# EAGLE design KineticHarvester_SIG_UFL_5 (EAGLE 9.6.2)
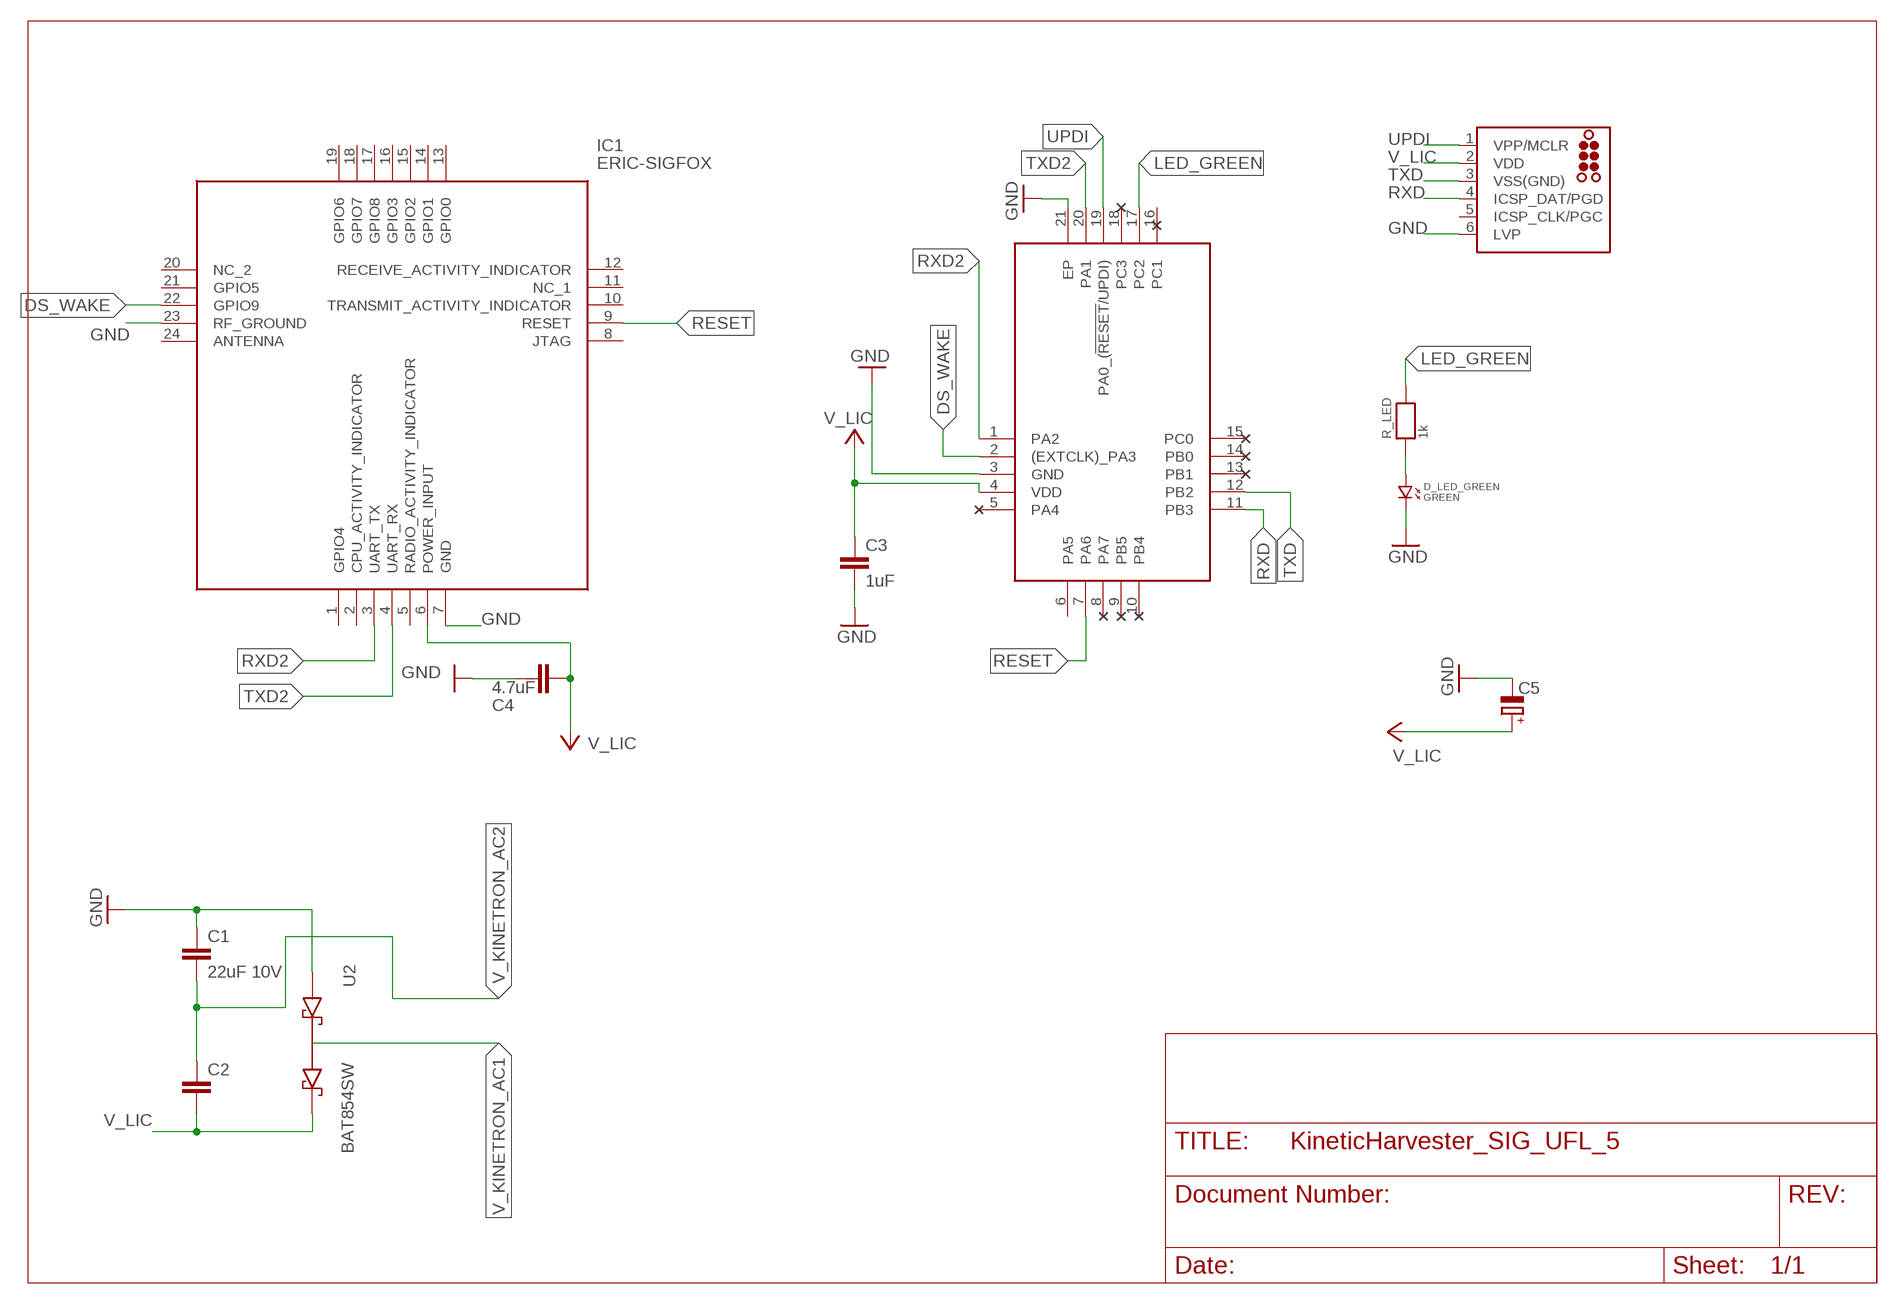
[diagram p0: schematic, sheet 1]

## Parts
ATTINY  ATTINY1616-MFR  [QFN40P300X300X90-21N]
C1  22uF 10V  C0603_22UF  [C0603]
C2  22uF 10V  C0603_22UF  [C0603]
C3  1uF  C0402_1UF  [C0402]
C4  4.7uF  C0402_4.7UF  [C0402]
C5  CPOL-EUE3.5-8  [E3,5-8]
D_LED_GREEN  GREEN  CMONR_STANDARDPARTS_LED.0402  [CMONR_STANDARDPARTS_0402.LED]
IC1  ERIC-SIGFOX  [ERICSIGFOX]
J1  TC2030-MCP-NL  [TC2030-MCP-NL]
R_LED  1k  MICROBUILDER_RESISTOR_0402MP  [MICROBUILDER__0402MP]
U2  BAT854SW  [SOT323]

## Nets
DS_WAKE: ATTINY.2((EXTCLK)_PA3) IC1.22(GPIO9)
GND: ATTINY.3(GND) ATTINY.21(EP) C1.1 C3.2 C4.2 C5.- D_LED_GREEN.P$2 IC1.7(GND) IC1.23(RF_GROUND) J1.6(LVP) U2.2(PIN1)
LED_GREEN: ATTINY.17(PC2) R_LED.2
N$9: D_LED_GREEN.P$1 R_LED.1
RESET: ATTINY.7(PA6) IC1.9(RESET)
RXD: ATTINY.11(PB3) J1.4(ICSP_DAT/PGD)
RXD2: ATTINY.1(PA2) IC1.3(UART_TX)
TXD: ATTINY.12(PB2) J1.3(VSS(GND))
TXD2: ATTINY.20(PA1) IC1.4(UART_RX)
UPDI: ATTINY.19(PA0_(!RESET!/UPDI)) J1.1(VPP/MCLR)
V_KINETRON_AC1: U2.1(PIN3)
V_KINETRON_AC2: C1.2 C2.1
V_LIC: ATTINY.4(VDD) C2.2 C3.1 C4.1 C5.+ IC1.6(POWER_INPUT) J1.2(VDD) U2.3(PIN2) ; supply symbol labelled VCC
Unconnected: ATTINY.5(PA4) ATTINY.6(PA5) ATTINY.8(PA7) ATTINY.9(PB5) ATTINY.10(PB4) ATTINY.13(PB1) ATTINY.14(PB0) ATTINY.15(PC0) ATTINY.16(PC1) ATTINY.18(PC3) IC1.1(GPIO4) IC1.2(CPU_ACTIVITY_INDICATOR) IC1.5(RADIO_ACTIVITY_INDICATOR) IC1.8(JTAG) IC1.10(TRANSMIT_ACTIVITY_INDICATOR) IC1.11(NC_1) IC1.12(RECEIVE_ACTIVITY_INDICATOR) IC1.13(GPIO0) IC1.14(GPIO1) IC1.15(GPIO2) IC1.16(GPIO3) IC1.17(GPIO8) IC1.18(GPIO7) IC1.19(GPIO6) IC1.20(NC_2) IC1.21(GPIO5) IC1.24(ANTENNA) J1.5(ICSP_CLK/PGC)

## Library data of the parts
ATTINY = ATTINY1616-MFR:ATTINY1616-MFR: 8-bit Microcontrollers - MCU 20MHz, 16KB, VQFN20, Ind 125C, Green, T&R Source: Datasheet <http://ww1.microchip.com/downloads/en/DeviceDoc/ATtiny806_1606_Data_Sheet_40002029A.pdf>; DESCRIPTION: 8-bit Microcontrollers - MCU 20MHz, 16KB, VQFN20, Ind 125C, Green, T&R; HEIGHT: 0.9mm; MANUFACTURER_NAME: Microchip; MANUFACTURER_PART_NUMBER: ATTINY1606-MFR; MOUSER_PART_NUMBER: 556-ATTINY1606-MFR; MOUSER_PRICE-STOCK: https://www.mouser.com/Search/Refine.aspx?Keyword=556-ATTINY1606-MFR
C1 C2 = TSEM:C: Non-polarized capacitor; FARNELL_OC: 2426957; MF: Murata; MPN: GRM188R61A226ME15D
C3 = TSEM:C: Non-polarized capacitor; FARNELL_OC: 2672103
C4 = TSEM:C: Non-polarized capacitor; FARNELL_OC: 2426952; MF: Murata; MPN: GRM155R60J475ME47D
C5 = qfm-trx1-24g:CPOL-EU: POLARIZED CAPACITOR, European symbol
D_LED_GREEN = TinyPICO:CMONR_STANDARDPARTS_LED
IC1 = eRIC-SIGFOX:ERIC-SIGFOX: LPRS eRIC-SIGFOX, Transceiver RF Transceiver 868 MHz, 2.5 5V Source: Datasheet <https://componentsearchengine.com/Datasheets/1/eRIC-SIGFOX.pdf>; DESCRIPTION: LPRS eRIC-SIGFOX, Transceiver RF Transceiver 868 MHz, 2.5 5V; HEIGHT: 2mm; MANUFACTURER_NAME: LPRS; MANUFACTURER_PART_NUMBER: eRIC-SIGFOX; MOUSER_PART_NUMBER: 471-ERIC-SIGFOX; MOUSER_PRICE-STOCK: https://www.mouser.co.uk/ProductDetail/LPRS/eRIC-SIGFOX?qs=j%252B1pi9TdxUYBWps9jLy%2Flg%3D%3D
J1 = tag-connect:TC2030: TAG-CONNECT ICSP Connector Manufacturer: Tag-Connect <http://www.tag-connect.com> Cable for easy In-Circuit Serial Programming. Designed for Microchip ICD2, suitable for many others. Two variants - one "with legs" (for hands-free fit on PCB) and another "without legs" for quick programming. PAD Description 1 MCLR/Vpp 2 Vdd 3 GND 4 PGD (ISPDAT) 5 PGC (ISPCLK) 6 nc (used for LVP) ©2009 ROFA.cz - modified and updated by Robert Darlington ‹rdarlington@gmail.com›
R_LED = TinyPICO:MICROBUILDER_RESISTOR: Resistors 0402 - 0402 Surface Mount Package 22 Ohm 1% 1/16W [Digikey: 311-22.0LRTR-ND] 33 Ohm 5% 1/16W 1.0K 5% 1/16W 1.5K 5% 1/16W 2.0K 1% 1/16W 10.0K 1% 1/16W [Digikey: 311-10.0KLRTR-ND] 10.0K 5% 1/16W [Digikey: RMCF0402JT10K0TR-ND] 12.1K 1% 1/16W [Digikey: 311-22.0LRTR-ND] 100.0K 5% 1/16W 0603 - 0603 Surface Mount Package 0 Ohm 1/10 Watt 1% Resistor 15 Ohm 1/10 Watt 1% Resistor 33 Ohm 1/10 Watt 1% Resistor 49.9 Ohm 1/10 Watt 1% Resistor 100 Ohm 1/10 Watt 1% Resistor 150 Ohm 1/10 Watt 1% Resistor 240 Ohm 1/10 Watt 1% Resistor 390 Ohm 1/10 Watt 1% Resistor 560 Ohm 1/10 Watt 1% Resistor 680 Ohm 1/10 Watt 1% Resistor 750 Ohm 1/10 Watt 1% Resistor 1.0K Ohm 1/10 Watt 1% Resistor 1.5K Ohm 1/10 Watt 1% Resistor 2.0K Ohm 1/10 Watt 1% Resistor 2.2K Ohm 1/10 Watt 1% Resistor 3.3K Ohm 1/10 Watt 1% Resistor 4.7K Ohm 1/10 Watt 1% Resistor 10.0K Ohm 1/10 Watt 1% Resistor 12.0K Ohm 1/10 Watt 1% Resistor 12.1K Ohm 1/10 Watt 1% Resistor 20.0K Ohm 1/10 Watt 1% Resistor 33.0K Ohm 1/10 Watt 1% Resistor 100.0K Ohm 1/10 Watt 1% Resistor 0805 - 0805 Surface Mount Package 0 Ohm 1/8 Watt 1% Resistor 33 Ohm 1/8 Watt 1% Resistor 100 Ohm 1/8 Watt 1% Resistor 150 Ohm 1/8 Watt 1% Resistor 200 Ohm 1/8 Watt 1% Resistor 240 Ohm 1/8 Watt 1% Resistor 330 Ohm 1/8 Watt 1% Resistor 390 Ohm 1/8 Watt 1% Resistor 470 Ohm 1/8 Watt 1% Resistor 1.0K Ohm 1/8 Watt 1% Resistor 1.5K Ohm 1/8 Watt 1% Resistor 2.0K Ohm 1/8 Watt 1% Resistor 4.7K Ohm 1/8 Watt 1% Resistor 5.1K Ohm 1/8 Watt 1% Resistor 5.6K Ohm 1/8 Watt 1% Resistor 10.0K Ohm 1/8 Watt 1% Resistor 22.0K Ohm 1/8 Watt 1% Resistor 33.0K Ohm 1/8 Watt 1% Resistor 100K Ohm 1/8 Watt 1% Resistor 1206 - 1206 Surface Mount Package 2012 - 2010 Surface Mount Package 0.11 Ohm 1/2 Watt 1% Resistor - Digikey: RHM.11UCT-ND
U2 = BAT854SW:BAT854SW: BAT854W series Schottky barrier (double) diodes source: http://www.nxp.com/documents/data_sheet/BAT854W_SERIES.pdf Check prices <https://pricing.snapeda.com/parts/BAT854SW/NXP%20Semiconductors/view-part?ref=eda>; AVAILABILITY: Bad; DESCRIPTION: Diode Array 1 Pair Series Connection Schottky 40V 200mA (DC) Surface Mount SC-70, SOT-323; MF: NXP Semiconductors; MP: BAT854SW; PACKAGE: None; PRICE: None

## Board
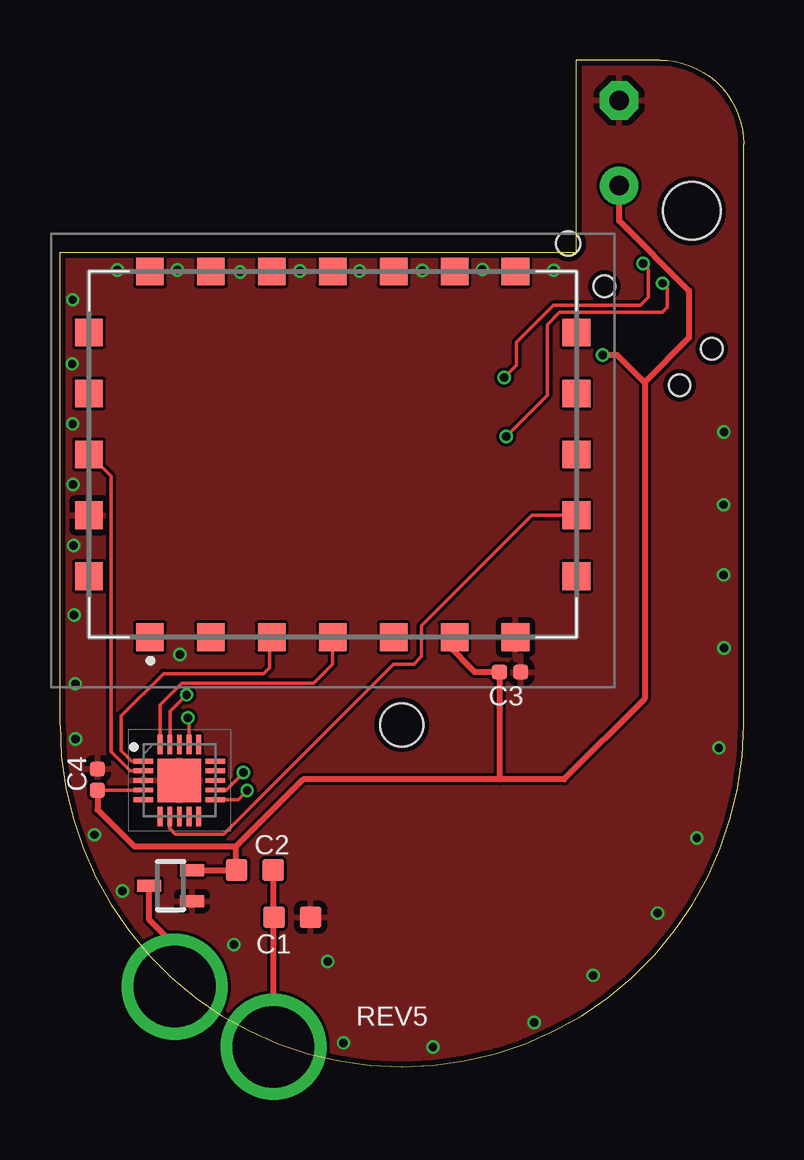
[diagram p1: board, top side]
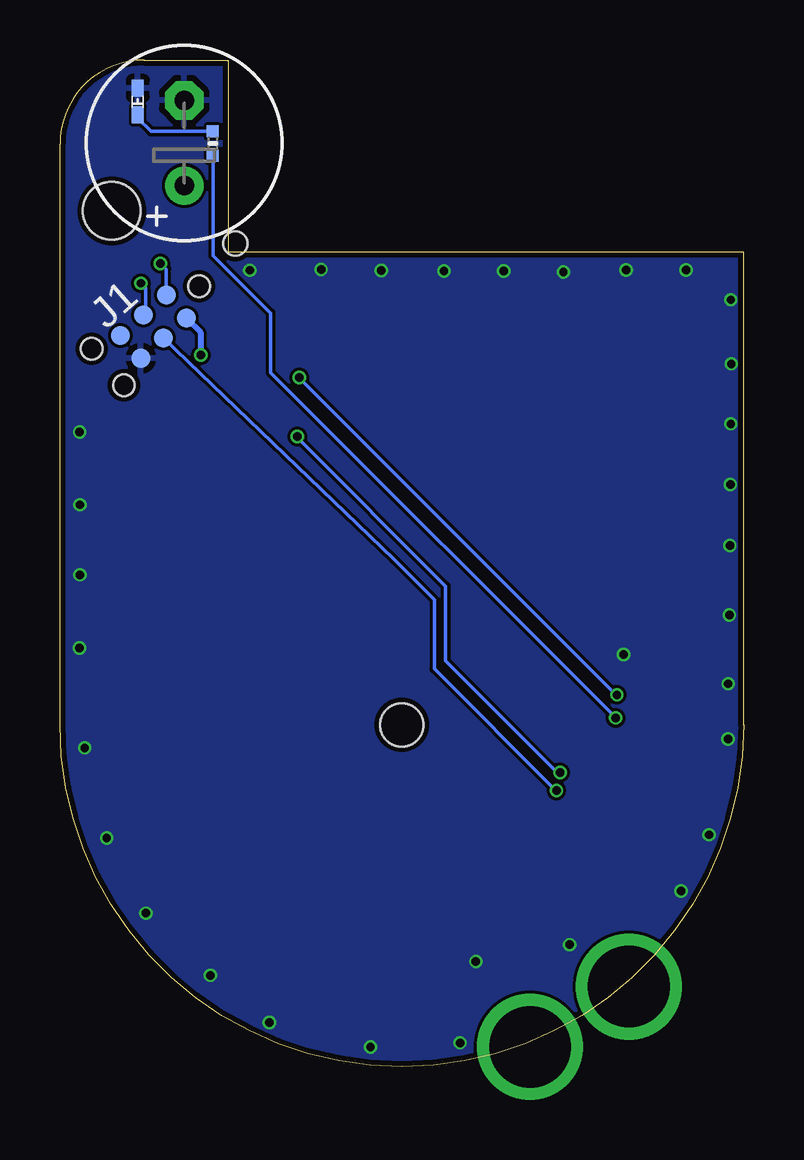
[diagram p2: board, bottom side, seen from below]

Size 28.5 x 41.95 mm. Coordinates in mm from the lower left corner, seen from the top.
Outline: 0,14.25 arc90 14.25,0 arc90 28.5,14.25 28.5,38.45 arc90 25,41.95 21.5,41.95 21.5,33.95 0,33.95 0,14.25
Copper layers (1*16): Top 0.0356mm / dielectric 0.1702mm / Bottom 0.0356mm
Design rules "default *": minimum track width 5mil, minimum drill 0.35mm, track to track 5mil, track to pad 5mil, pad to pad 5mil, via to via 5mil, smd to smd 5mil, copper to edge 9mil, drill to drill 6mil, minimum pad ring 4mil, minimum via ring 4mil, stop-mask expansion 0mil, vias tented up to drill 0.35mm, thermal gap 10mil
Holes 1.8 mm at 14.25,14.25
Holes 2.4 mm at 26.34,35.66
Holes 1 mm at 21.19,34.3

### Footprints (pad centres in the part's own frame; a part is rotated, then mirrored left to right if it is on the bottom)
QFN40P300X300X90-21N = smd 0.8 x 0.2: 1 -1.5,0.8; 2 -1.5,0.4; 3 -1.5,0; 4 -1.5,-0.4; 5 -1.5,-0.8; 11 1.5,-0.8; 12 1.5,-0.4; 13 1.5,0; 14 1.5,0.4; 15 1.5,0.8 | smd 0.2 x 0.8: 6 -0.8,-1.5; 7 -0.4,-1.5; 8 0,-1.5; 9 0.4,-1.5; 10 0.8,-1.5; 16 0.8,1.5; 17 0.4,1.5; 18 0,1.5; 19 -0.4,1.5; 20 -0.8,1.5 | smd 1.8 x 1.8: 21 0,0
C0603 = smd 0.889 x 0.889: 1 -0.762,0; 2 0.762,0
C0402 = smd 0.635 x 0.635: 1 -0.445,0; 2 0.445,0
E3,5-8 = drill 0.813 pad 1.6: + -1.778,0 | drill 0.813 pad 1.6 octagon: - 1.778,0
CMONR_STANDARDPARTS_0402.LED = smd 0.7 x 0.5: P$1 -0.55,0; P$2 0.55,0
ERICSIGFOX = smd 1.15 x 1.15: 1 -7.62,-7.62; 2 -5.08,-7.62; 3 -2.54,-7.62; 4 0,-7.62; 5 2.54,-7.62; 6 5.08,-7.62; 7 7.62,-7.62; 8 10.16,-5.08; 9 10.16,-2.54; 10 10.16,0; 11 10.16,2.54; 12 10.16,5.08; 13 7.62,7.62; 14 5.08,7.62; 15 2.54,7.62; 16 0,7.62; 17 -2.54,7.62; 18 -5.08,7.62; 19 -7.62,7.62; 20 -10.16,5.08; 21 -10.16,2.54; 22 -10.16,0; 23 -10.16,-2.54; 24 -10.16,-5.08
TC2030-MCP-NL = smd 0.787 x 0.787: 1 1.27,-0.635; 2 1.27,0.635; 3 2.54,-0.635; 4 2.54,0.635; 5 3.81,-0.635; 6 3.81,0.635 | hole 0.889: 0,0; 5.08,-1.016; 5.08,1.016
MICROBUILDER__0402MP = smd 0.5 x 0.5: 1 -0.508,0; 2 0.508,0
SOT323 = smd 0.5 x 1: 1 0,0.9; 2 -0.65,-0.9; 3 0.65,-0.9

### Placement (x,y rotation side)
ATTINY  4.98,11.93 0 top
C1  9.69,6.23 180 top
C2  8.13,8.2 180 top
C3  18.77,16.45 0 top
C4  1.57,11.97 90 top
C5  23.32,38.49 90 bottom
D_LED_GREEN  25.26,40.22 90 bottom
IC1  11.37,25.52 0 top
J1  22.7,32.52 221.5 bottom
R_LED  22.13,38.47 270 bottom
U2  4.61,7.55 90 top

### Tracks (layer width: path | path; a pad name or v marks a point on that pad's centre or on a via)
DS_WAKE
  Top 0.152: ATTINY.2 2.93,12.34 2.13,13.13 2.13,24.6 IC1.22
GND  (via drill 0.35)
  other vias: 1.44,9.67 2.6,7.33 7.25,5.09 11.16,4.39 27.68,26.45 27.67,20.5 27.69,17.45 27.47,13.29 26.55,9.53 24.92,6.4 22.23,3.81 19.77,1.85 11.82,1 0.65,13.66 0.59,18.83 0.57,21.72 0.55,24.26 0.53,26.79 0.51,29.29 0.53,31.96 5,17.18 2.4,33.2 4.9,33.2 7.51,33.12 10,33.16 12.49,33.16 15.1,33.18 17.61,33.22 20.58,33.19 27.67,23.42 15.55,0.83 0.64,15.96
  pour Top: -1.64,43.19 -1.64,-2.15 30.67,-2.15 30.67,43.19
  pour Bottom: -1.63,43.32 -1.63,-2.08 30.62,-2.08 30.62,43.32
LED_GREEN  (via drill 0.35)
  Top 0.152: v5.33,14.54 v5.34,14.54 5.38,14.5 ATTINY.17
  Bottom 0.152: v5.33,14.54 19.71,28.92 19.71,31.4 22.11,33.79 22.11,37.94 R_LED.2
N$9
  Bottom 0.152: D_LED_GREEN.P$1 25.26,39.53 24.71,38.98 R_LED.1
RESET
  Top 0.152: ATTINY.7 4.58,9.93 4.81,9.7 6.83,9.7 13.9,16.77 14.75,16.77 15.08,17.1 15.08,18.38 19.68,22.98 IC1.9
RXD  (via drill 0.35)
  Top 0.152: v7.8,11.51 7.42,11.13 ATTINY.11
  Bottom 0.152: v7.8,11.51 7.82,11.51 12.89,16.58 12.89,19.45 14.58,21.14 J1.4
RXD2
  Top 0.152: IC1.3 8.74,17.81 8.74,16.63 8.49,16.38 4.32,16.38 2.56,14.62 2.56,13.17 2.99,12.73 ATTINY.1
TXD  (via drill 0.35)
  Top 0.152: ATTINY.12 6.93,11.53 v7.65,12.25 v7.65,12.26 | v25.13,32.65 25.33,32.45 25.33,31.65 25.11,31.43 20.83,31.43 20.32,30.92 20.32,27.98 v18.6,26.26
  Bottom 0.152: v7.65,12.26 7.77,12.26 12.42,16.91 12.42,20.03 18.6,26.21 v18.6,26.26 | v25.13,32.65 24.93,32.45 24.93,31.41 J1.3
TXD2
  Top 0.152: ATTINY.20 4.18,13.75 4.19,13.76 4.19,15.09 5.08,15.98 10.57,15.98 11.37,16.78 IC1.4
UPDI  (via drill 0.35)
  Top 0.152: ATTINY.19 4.59,14.81 v5.28,15.5 | v24.31,33.47 24.54,33.24 24.54,32.07 24.2,31.73 20.57,31.73 19.04,30.2 19.04,29.24 v18.52,28.72
  Bottom 0.152: v5.28,15.5 5.33,15.5 18.52,28.69 v18.52,28.72 | v24.31,33.47 24.07,33.23 J1.1
V_KINETRON_AC1  (via drill 3.4)
  Top 0.254: v4.78,3.34 4.78,5.06 3.71,6.13 U2.1
V_KINETRON_AC2  (via drill 3.4)
  Top 0.152: 8.9,6.23 C1.2
  Top 0.254: v8.9,0.83 8.9,6.23 | C2.1 8.89,6.27 C1.2
V_LIC  (via drill 0.35)
  Top 0.152: C2.2 7.35,8.22 | C4.1 ATTINY.4 | 16.15,17.6 IC1.6 | 18.33,12 18.35,11.97
  Top 0.254: 7.35,9.18 7.3,9.18 3.1,9.18 1.57,10.71 C4.1 | 7.35,9.18 10.14,11.97 18.35,11.97 21.01,11.97 24.38,15.34 24.38,28.5 | U2.3 C2.2 | 7.35,8.22 7.35,9.18 | C5.+ 23.32,35.24 26.22,32.34 26.22,30.37 24.38,28.53 24.38,28.5 | 16.15,17.6 17.3,16.45 C3.1 18.33,12 | 24.38,28.5 23.22,29.66 v22.63,29.66
  Bottom 0.254: J1.2 23.23,31.2 22.64,30.61 v22.64,29.67 v22.63,29.66

### Text on the board
tNames: REV5